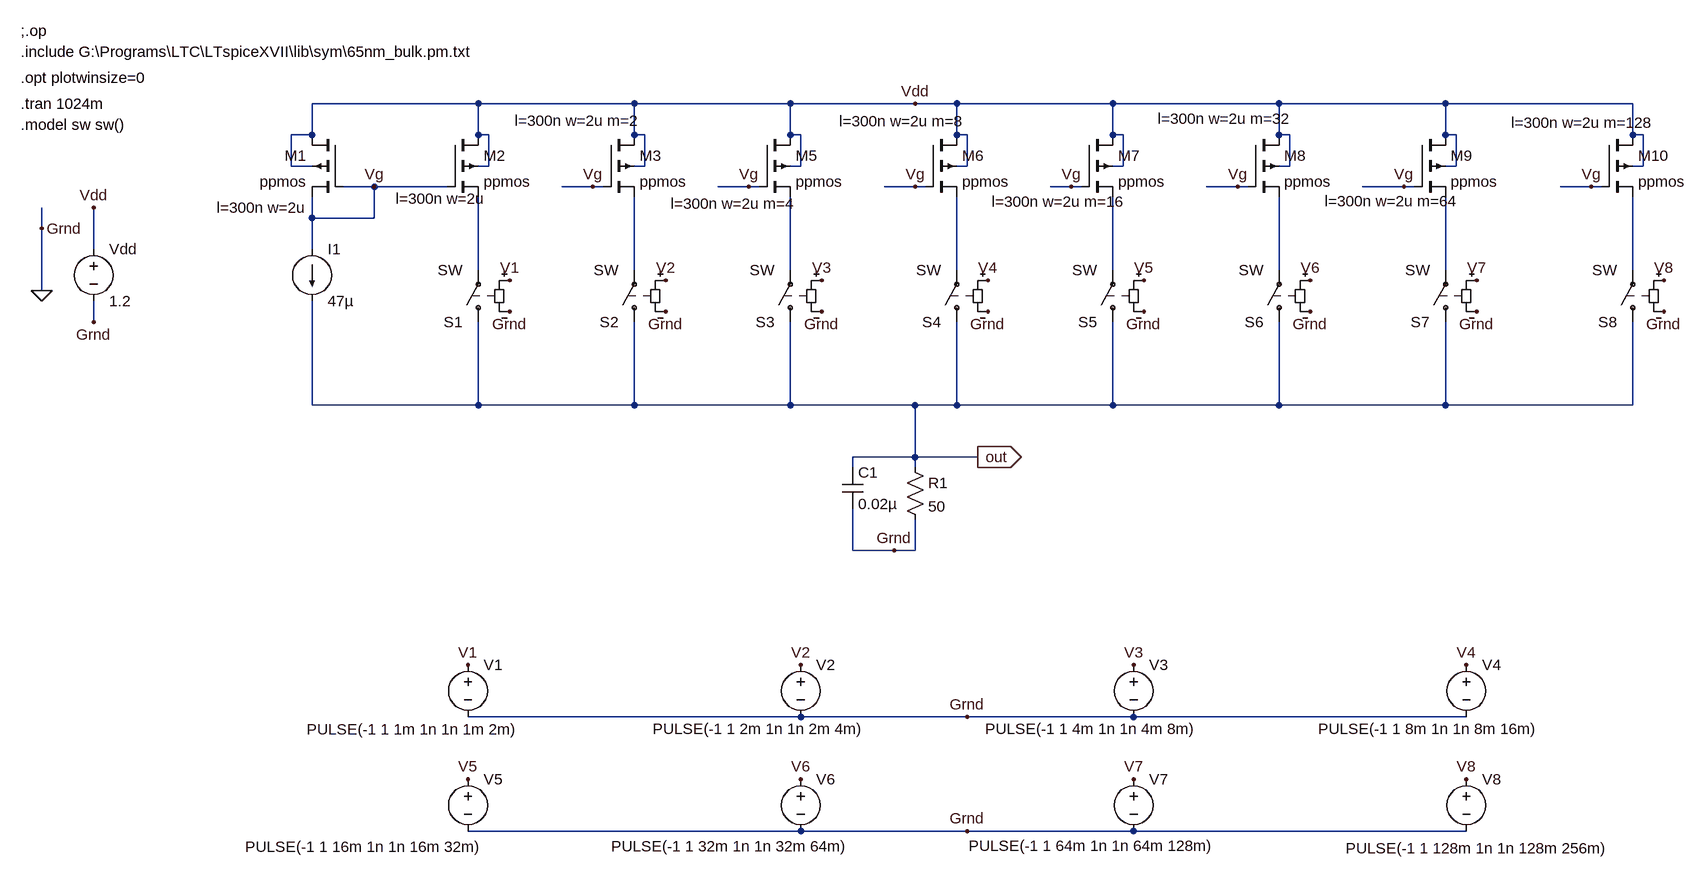
[diagram p0: schematic DAC_simple.asc]
DAC_simple.asc, the LTspice schematic file:
Version 4
SHEET 1 2528 1104
WIRE 384 -80 128 -80
WIRE 624 -80 384 -80
WIRE 864 -80 624 -80
WIRE 1056 -80 864 -80
WIRE 1120 -80 1056 -80
WIRE 1360 -80 1120 -80
WIRE 1616 -80 1360 -80
WIRE 1872 -80 1616 -80
WIRE 2160 -80 1872 -80
WIRE 128 -32 128 -80
WIRE 128 -32 96 -32
WIRE 384 -32 384 -80
WIRE 400 -32 384 -32
WIRE 624 -32 624 -80
WIRE 640 -32 624 -32
WIRE 864 -32 864 -80
WIRE 880 -32 864 -32
WIRE 1120 -32 1120 -80
WIRE 1136 -32 1120 -32
WIRE 1360 -32 1360 -80
WIRE 1376 -32 1360 -32
WIRE 1616 -32 1616 -80
WIRE 1632 -32 1616 -32
WIRE 1872 -32 1872 -80
WIRE 1888 -32 1872 -32
WIRE 2160 -32 2160 -80
WIRE 2176 -32 2160 -32
WIRE 96 16 96 -32
WIRE 128 16 96 16
WIRE 400 16 400 -32
WIRE 400 16 384 16
WIRE 640 16 640 -32
WIRE 640 16 624 16
WIRE 880 16 880 -32
WIRE 880 16 864 16
WIRE 1136 16 1136 -32
WIRE 1136 16 1120 16
WIRE 1376 16 1376 -32
WIRE 1376 16 1360 16
WIRE 1632 16 1632 -32
WIRE 1632 16 1616 16
WIRE 1888 16 1888 -32
WIRE 1888 16 1872 16
WIRE 2176 16 2176 -32
WIRE 2176 16 2160 16
WIRE 224 48 176 48
WIRE 336 48 224 48
WIRE 560 48 512 48
WIRE 576 48 560 48
WIRE 800 48 752 48
WIRE 816 48 800 48
WIRE 1056 48 1008 48
WIRE 1072 48 1056 48
WIRE 1296 48 1264 48
WIRE 1312 48 1296 48
WIRE 1552 48 1504 48
WIRE 1568 48 1552 48
WIRE 1808 48 1744 48
WIRE 1824 48 1808 48
WIRE 2096 48 2048 48
WIRE 2112 48 2096 48
WIRE 128 96 128 64
WIRE 224 96 224 48
WIRE 224 96 128 96
WIRE -288 112 -288 80
WIRE -208 144 -208 80
WIRE 128 144 128 96
WIRE 384 176 384 64
WIRE 624 176 624 64
WIRE 864 176 864 64
WIRE 1120 176 1120 64
WIRE 1360 176 1360 64
WIRE 1616 176 1616 64
WIRE 1872 176 1872 64
WIRE 2160 176 2160 64
WIRE -288 208 -288 112
WIRE -208 256 -208 224
WIRE 128 384 128 224
WIRE 384 384 384 256
WIRE 384 384 128 384
WIRE 624 384 624 256
WIRE 624 384 384 384
WIRE 864 384 864 256
WIRE 864 384 624 384
WIRE 1056 384 864 384
WIRE 1120 384 1120 256
WIRE 1120 384 1056 384
WIRE 1360 384 1360 256
WIRE 1360 384 1120 384
WIRE 1616 384 1616 256
WIRE 1616 384 1360 384
WIRE 1872 384 1872 256
WIRE 1872 384 1616 384
WIRE 2160 384 2160 256
WIRE 2160 384 1872 384
WIRE 1056 464 1056 384
WIRE 1056 464 960 464
WIRE 1152 464 1056 464
WIRE 960 480 960 464
WIRE 1056 480 1056 464
WIRE 960 608 960 544
WIRE 1024 608 960 608
WIRE 1056 608 1056 560
WIRE 1056 608 1024 608
WIRE 880 864 368 864
WIRE 1136 864 880 864
WIRE 1392 864 1136 864
WIRE 1904 864 1392 864
WIRE 880 1040 368 1040
WIRE 1136 1040 880 1040
WIRE 1392 1040 1136 1040
WIRE 1904 1040 1392 1040
FLAG -288 208 0
FLAG -208 80 Vdd
FLAG -288 112 Grnd
FLAG -208 256 Grnd
FLAG 1024 608 Grnd
FLAG 1136 864 Grnd
FLAG 1136 1040 Grnd
FLAG 432 240 Grnd
FLAG 672 240 Grnd
FLAG 912 240 Grnd
FLAG 1168 240 Grnd
FLAG 1408 240 Grnd
FLAG 1664 240 Grnd
FLAG 1920 240 Grnd
FLAG 2208 240 Grnd
FLAG 368 784 V1
FLAG 432 192 V1
FLAG 880 784 V2
FLAG 672 192 V2
FLAG 912 192 V3
FLAG 1168 192 V4
FLAG 1408 192 V5
FLAG 1664 192 V6
FLAG 1920 192 V7
FLAG 2208 192 V8
FLAG 1904 784 V4
FLAG 1392 784 V3
FLAG 368 960 V5
FLAG 880 960 V6
FLAG 1392 960 V7
FLAG 1904 960 V8
FLAG 1152 464 out
IOPIN 1152 464 Out
FLAG 1056 -80 Vdd
FLAG 224 48 Vg
FLAG 560 48 Vg
FLAG 800 48 Vg
FLAG 1056 48 Vg
FLAG 1296 48 Vg
FLAG 1552 48 Vg
FLAG 1808 48 Vg
FLAG 2096 48 Vg
SYMBOL voltage -208 128 R0
WINDOW 123 0 0 Left 0
WINDOW 39 0 0 Left 0
SYMATTR InstName Vdd
SYMATTR Value 1.2
SYMBOL current 128 144 R0
WINDOW 123 0 0 Left 0
WINDOW 39 0 0 Left 0
SYMATTR InstName I1
SYMATTR Value 47µ
SYMBOL res 1040 464 R0
SYMATTR InstName R1
SYMATTR Value 50
SYMBOL sw 384 272 R180
SYMATTR InstName S1
SYMBOL sw 624 272 R180
SYMATTR InstName S2
SYMBOL sw 864 272 R180
SYMATTR InstName S3
SYMBOL sw 1120 272 R180
SYMATTR InstName S4
SYMBOL sw 1360 272 R180
SYMATTR InstName S5
SYMBOL sw 1616 272 R180
SYMATTR InstName S6
SYMBOL sw 1872 272 R180
SYMATTR InstName S7
SYMBOL sw 2160 272 R180
SYMATTR InstName S8
SYMBOL pmos4 176 -32 M0
WINDOW 123 56 112 Left 2
SYMATTR Value2 l=300n w=2u
SYMATTR InstName M1
SYMATTR Value ppmos
SYMBOL pmos4 336 -32 R0
WINDOW 123 -79 98 Left 2
SYMATTR Value2 l=300n w=2u
SYMATTR InstName M2
SYMATTR Value ppmos
SYMBOL pmos4 576 -32 R0
WINDOW 123 -136 -22 Left 2
SYMATTR Value2 l=300n w=2u m=2
SYMATTR InstName M3
SYMATTR Value ppmos
SYMBOL pmos4 816 -32 R0
WINDOW 123 -136 106 Left 2
SYMATTR Value2 l=300n w=2u m=4
SYMATTR InstName M5
SYMATTR Value ppmos
SYMBOL pmos4 1072 -32 R0
WINDOW 123 -133 -21 Left 2
SYMATTR Value2 l=300n w=2u m=8
SYMATTR InstName M6
SYMATTR Value ppmos
SYMBOL pmos4 1312 -32 R0
WINDOW 123 -138 103 Left 2
SYMATTR Value2 l=300n w=2u m=16
SYMATTR InstName M7
SYMATTR Value ppmos
SYMBOL pmos4 1568 -32 R0
WINDOW 123 -139 -25 Left 2
SYMATTR Value2 l=300n w=2u m=32
SYMATTR InstName M8
SYMATTR Value ppmos
SYMBOL pmos4 1824 -32 R0
WINDOW 123 -138 102 Left 2
SYMATTR Value2 l=300n w=2u m=64
SYMATTR InstName M9
SYMATTR Value ppmos
SYMBOL pmos4 2112 -32 R0
WINDOW 123 -139 -19 Left 2
SYMATTR Value2 l=300n w=2u m=128
SYMATTR InstName M10
SYMATTR Value ppmos
SYMBOL voltage 368 768 R0
WINDOW 3 -248 115 Left 2
WINDOW 123 0 0 Left 0
WINDOW 39 0 0 Left 0
SYMATTR Value PULSE(-1 1 1m 1n 1n 1m 2m)
SYMATTR InstName V1
SYMBOL voltage 880 768 R0
WINDOW 3 -228 114 Left 2
WINDOW 123 0 0 Left 0
WINDOW 39 0 0 Left 0
SYMATTR Value PULSE(-1 1 2m 1n 1n 2m 4m)
SYMATTR InstName V2
SYMBOL voltage 1392 768 R0
WINDOW 3 -228 114 Left 2
WINDOW 123 0 0 Left 0
WINDOW 39 0 0 Left 0
SYMATTR Value PULSE(-1 1 4m 1n 1n 4m 8m)
SYMATTR InstName V3
SYMBOL voltage 1904 768 R0
WINDOW 3 -228 114 Left 2
WINDOW 123 0 0 Left 0
WINDOW 39 0 0 Left 0
SYMATTR Value PULSE(-1 1 8m 1n 1n 8m 16m)
SYMATTR InstName V4
SYMBOL voltage 368 944 R0
WINDOW 3 -343 120 Left 2
WINDOW 123 0 0 Left 0
WINDOW 39 0 0 Left 0
SYMATTR Value PULSE(-1 1 16m 1n 1n 16m 32m)
SYMATTR InstName V5
SYMBOL voltage 880 944 R0
WINDOW 3 -292 119 Left 2
WINDOW 123 0 0 Left 0
WINDOW 39 0 0 Left 0
SYMATTR Value PULSE(-1 1 32m 1n 1n 32m 64m)
SYMATTR InstName V6
SYMBOL voltage 1392 944 R0
WINDOW 3 -254 118 Left 2
WINDOW 123 0 0 Left 0
WINDOW 39 0 0 Left 0
SYMATTR Value PULSE(-1 1 64m 1n 1n 64m 128m)
SYMATTR InstName V7
SYMBOL voltage 1904 944 R0
WINDOW 3 -186 122 Left 2
WINDOW 123 0 0 Left 0
WINDOW 39 0 0 Left 0
SYMATTR Value PULSE(-1 1 128m 1n 1n 128m 256m)
SYMATTR InstName V8
SYMBOL cap 944 480 R0
SYMATTR InstName C1
SYMATTR Value 0.02µ
TEXT -320 -160 Left 2 !.include G:\\Programs\\LTC\\LTspiceXVII\\lib\\sym\\65nm_bulk.pm.txt
TEXT -320 -120 Left 2 !.opt plotwinsize=0
TEXT -320 -80 Left 2 !.tran 1024m
TEXT -320 -48 Left 2 !.model sw sw()
TEXT -320 -192 Left 2 !;.op

The netlist it stands for:
* DAC_simple.asc
Vdd Vdd 0 1.2
I1 Vg out 47µ
R1 out 0 50
S1 out N001 V1 0 SW
S2 out N002 V2 0 SW
S3 out N003 V3 0 SW
S4 out N004 V4 0 SW
S5 out N005 V5 0 SW
S6 out N006 V6 0 SW
S7 out N007 V7 0 SW
S8 out N008 V8 0 SW
M1 Vdd Vg Vg Vdd ppmos l=300n w=2u
M2 Vdd Vg N001 Vdd ppmos l=300n w=2u
M3 Vdd Vg N002 Vdd ppmos l=300n w=2u m=2
M5 Vdd Vg N003 Vdd ppmos l=300n w=2u m=4
M6 Vdd Vg N004 Vdd ppmos l=300n w=2u m=8
M7 Vdd Vg N005 Vdd ppmos l=300n w=2u m=16
M8 Vdd Vg N006 Vdd ppmos l=300n w=2u m=32
M9 Vdd Vg N007 Vdd ppmos l=300n w=2u m=64
M10 Vdd Vg N008 Vdd ppmos l=300n w=2u m=128
V1 V1 0 PULSE(-1 1 1m 1n 1n 1m 2m)
V2 V2 0 PULSE(-1 1 2m 1n 1n 2m 4m)
V3 V3 0 PULSE(-1 1 4m 1n 1n 4m 8m)
V4 V4 0 PULSE(-1 1 8m 1n 1n 8m 16m)
V5 V5 0 PULSE(-1 1 16m 1n 1n 16m 32m)
V6 V6 0 PULSE(-1 1 32m 1n 1n 32m 64m)
V7 V7 0 PULSE(-1 1 64m 1n 1n 64m 128m)
V8 V8 0 PULSE(-1 1 128m 1n 1n 128m 256m)
C1 out 0 0.02µ
.model NMOS NMOS
.model PMOS PMOS
.lib standard.mos
.include G:\Programs\LTC\LTspiceXVII\lib\sym\65nm_bulk.pm.txt
.opt plotwinsize=0
.tran 1024m
.model sw sw()
;.op
.backanno
.end